# EAGLE design pneumatic_horse (EAGLE 9.6.2)
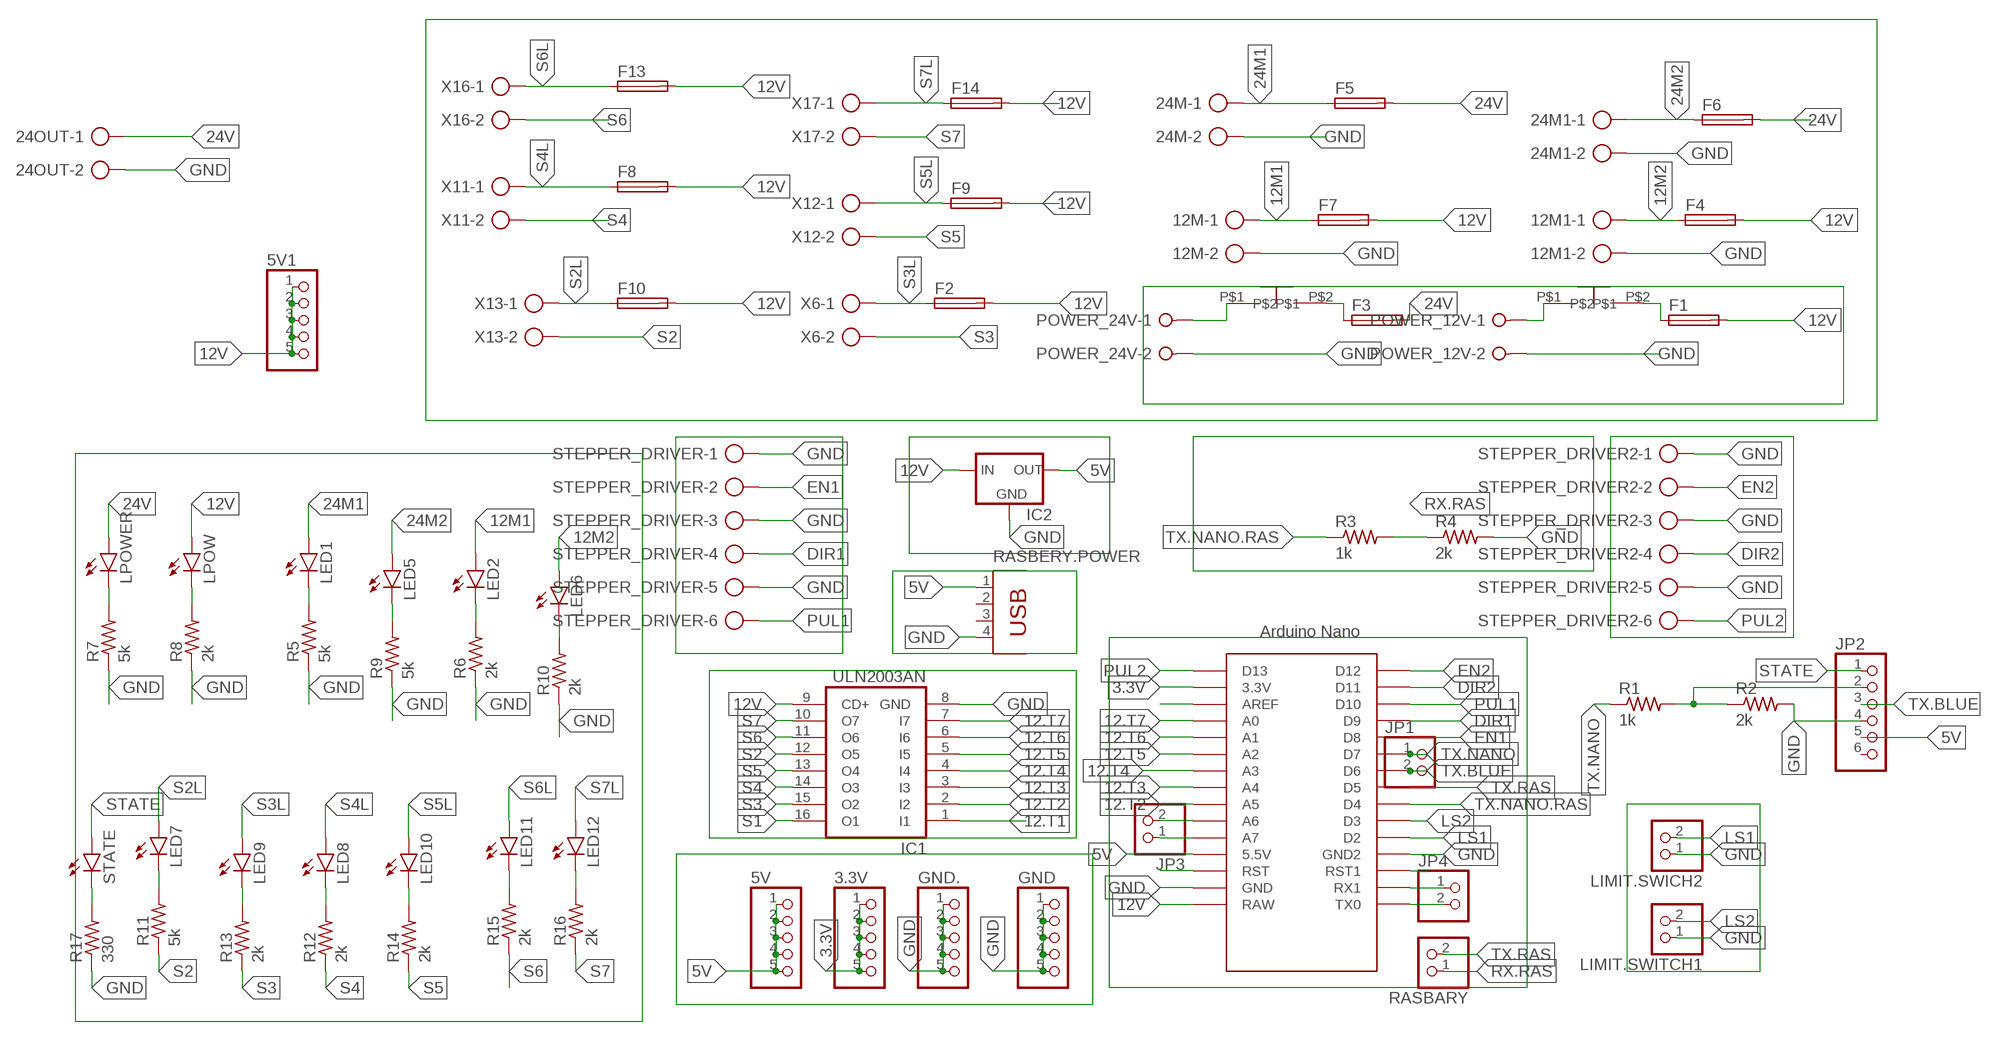
[diagram p0: schematic, sheet 1]

## Parts
3.3V  PINHD-1X5  [1X05]
5V  PINHD-1X5  [1X05]
5V1  PINHD-1X5  [1X05]
12M  AK300/2  [AK300/2]
12M1  AK300/2  [AK300/2]
24M  AK300/2  [AK300/2]
24M1  AK300/2  [AK300/2]
24OUT  AK300/2  [AK300/2]
F1  SH22,5A  [SH22,5A]
F2  SH22,5A  [SH22,5A]
F3  SH22,5A  [SH22,5A]
F4  SH22,5A  [SH22,5A]
F5  SH22,5A  [SH22,5A]
F6  SH22,5A  [SH22,5A]
F7  SH22,5A  [SH22,5A]
F8  SH22,5A  [SH22,5A]
F9  SH22,5A  [SH22,5A]
F10  SH22,5A  [SH22,5A]
F13  SH22,5A  [SH22,5A]
F14  SH22,5A  [SH22,5A]
GND  PINHD-1X5  [1X05]
GND.  PINHD-1X5  [1X05]
IC1  ULN2003AN  [DIL16]
IC2  78XXS  [78XXS]
JP1  PINHD-1X2  [1X02]
JP2  PINHD-1X6  [1X06]
JP3  PINHD-1X2  [1X02]
JP4  PINHD-1X2  [1X02]
LED1  LED3MM  [LED3MM]
LED2  LED3MM  [LED3MM]
LED5  LED3MM  [LED3MM]
LED6  LED3MM  [LED3MM]
LED7  LED3MM  [LED3MM]
LED8  LED3MM  [LED3MM]
LED9  LED3MM  [LED3MM]
LED10  LED3MM  [LED3MM]
LED11  LED3MM  [LED3MM]
LED12  LED3MM  [LED3MM]
LIMIT.SWICH2  PINHD-1X2  [1X02]
LIMIT.SWITCH1  PINHD-1X2  [1X02]
LPOW  LED5MM  [LED5MM]
LPOWER  LED3MM  [LED3MM]
POWER_12V  W237-2N  [W237-2N]
POWER_24V  W237-2N  [W237-2N]
R1  1k  R-US_0204/7  [0204/7]
R2  2k  R-US_0204/7  [0204/7]
R3  1k  R-US_0204/7  [0204/7]
R4  2k  R-US_0204/7  [0204/7]
R5  5k  R-US_0204/7  [0204/7]
R6  2k  R-US_0204/7  [0204/7]
R7  5k  R-US_0204/7  [0204/7]
R8  2k  R-US_0204/7  [0204/7]
R9  5k  R-US_0204/7  [0204/7]
R10  2k  R-US_0204/7  [0204/7]
R11  5k  R-US_0204/5  [0204/5]
R12  2k  R-US_0204/5  [0204/5]
R13  2k  R-US_0204/5  [0204/5]
R14  2k  R-US_0204/5  [0204/5]
R15  2k  R-US_0204/5  [0204/5]
R16  2k  R-US_0204/5  [0204/5]
R17  330  R-US_0204/5  [0204/5]
RASBARY  PINHD-1X2  [1X02]
RASBERY.POWER  PN87520  [PN87520]
STATE  LED3MM  [LED3MM]
STEPPER_DRIVER  AK300/6  [AK300/6]
STEPPER_DRIVER2  AK300/6  [AK300/6]
U$1  NANO  [NANO]
U$2  ON_OFF  [ON_OFF]
U$3  ON_OFF  [ON_OFF]
X6  AK300/2  [AK300/2]
X11  AK300/2  [AK300/2]
X12  AK300/2  [AK300/2]
X13  AK300/2  [AK300/2]
X16  AK300/2  [AK300/2]
X17  AK300/2  [AK300/2]

## Nets
3.3V: 3.3V.1 3.3V.2 3.3V.3 3.3V.4 3.3V.5 U$1.3.3V
5V: 5V.1 5V.2 5V.3 5V.4 5V.5 IC2.OUT JP2.5 RASBERY.POWER.1 U$1.5V(5.5V)
12.T1: IC1.1(I1)
12.T2: IC1.2(I2) U$1.A5
12.T3: IC1.3(I3) U$1.A4
12.T4: IC1.4(I4) U$1.A3
12.T5: IC1.5(I5) U$1.A2
12.T6: IC1.6(I6) U$1.A1
12.T7: IC1.7(I7) U$1.A0
12M1: 12M.1 F7.1 LED2.A
12M2: 12M1.1 F4.1 LED6.A
12V: 5V1.1 5V1.2 5V1.3 5V1.4 5V1.5 F1.2 F2.2 F4.2 F7.2 F8.2 F9.2 F10.2 F13.2 F14.2 IC1.9(CD+) IC2.IN LPOW.A U$1.RAW
24M1: 24M.1 F5.1 LED1.A
24M2: 24M1.1 F6.1 LED5.A
24V: 24OUT.1 F3.2 F5.2 F6.2 LPOWER.A
DIR1: STEPPER_DRIVER.4 U$1.D9
DIR2: STEPPER_DRIVER2.4 U$1.D11
EN1: STEPPER_DRIVER.2 U$1.D8
EN2: STEPPER_DRIVER2.2 U$1.D12
GND: 12M1.2 12M.2 24M1.2 24M.2 24OUT.2 GND.1 GND.2 GND.3 GND.4 GND.5 GND..1 GND..2 GND..3 GND..4 GND..5 IC1.8(GND) IC2.GND JP2.4 LIMIT.SWICH2.1 LIMIT.SWITCH1.1 POWER_12V.2 POWER_24V.2 R2.2 R4.2 R5.1 R6.1 R7.1 R8.1 R9.1 R10.1 R17.1 RASBERY.POWER.4 STEPPER_DRIVER2.1 STEPPER_DRIVER2.3 STEPPER_DRIVER2.5 STEPPER_DRIVER.1 STEPPER_DRIVER.3 STEPPER_DRIVER.5 U$1.GND U$1.GND1(GND2)
LS1: LIMIT.SWICH2.2 U$1.D2
LS2: LIMIT.SWITCH1.2 U$1.D3
N$1: POWER_24V.1 U$2.P$1
N$2: LED1.K(C) R5.2
N$4: F3.1 U$2.P$2
N$5: LED2.K(C) R6.2
N$7: LED5.K(C) R9.2
N$8: LED6.K(C) R10.2
N$9: LED7.K(C) R11.2
N$10: LPOWER.K(C) R7.2
N$11: LPOW.K(C) R8.2
N$12: LED8.K(C) R12.2
N$13: U$1.RST1
N$14: JP4.1 U$1.RX1
N$15: JP4.2 U$1.TX0
N$16: LED9.K(C) R13.2
N$18: U$1.AREF
N$19: LED10.K(C) R14.2
N$20: LED11.K(C) R15.2
N$21: LED12.K(C) R16.2
N$23: JP3.1 U$1.A7
N$25: JP3.2 U$1.A6
N$28: U$1.RST
N$34: JP2.2 R1.2 R2.1
N$35: R17.2 STATE.K(C)
N$36: POWER_12V.1 U$3.P$1
N$37: F1.1 U$3.P$2
PUL1: STEPPER_DRIVER.6 U$1.D10
PUL2: STEPPER_DRIVER2.6 U$1.D13
RX.RAS: R3.2 R4.1 RASBARY.1
S1: IC1.16(O1)
S2: IC1.12(O5) R11.1 X13.2
S2L: F10.1 LED7.A X13.1
S3: IC1.15(O2) R13.1 X6.2
S3L: F2.1 LED9.A X6.1
S4: IC1.14(O3) R12.1 X11.2
S4L: F8.1 LED8.A X11.1
S5: IC1.13(O4) R14.1 X12.2
S5L: F9.1 LED10.A X12.1
S6: IC1.11(O6) R15.1 X16.2
S6L: F13.1 LED11.A X16.1
S7: IC1.10(O7) R16.1 X17.2
S7L: F14.1 LED12.A X17.1
STATE: JP2.1 STATE.A
TX.BLUE: JP1.2 JP2.3 U$1.D6
TX.NANO: JP1.1 R1.1 U$1.D7
TX.NANO.RAS: R3.1 U$1.D4
TX.RAS: RASBARY.2 U$1.D5
Unconnected: JP2.6 RASBERY.POWER.2 RASBERY.POWER.3

## Library data of the parts
3.3V 5V 5V1 GND GND. = pinhead:PINHD-1X5: PIN HEADER
12M 12M1 24M 24M1 24OUT X6 X11-X13 X16 X17 = con-ptr500:AK300/2: CONNECTOR; OC_FARNELL: unknown; OC_NEWARK: unknown
F1-F10 F13 F14 = fuse:SH22,5A: FUSE HOLDER grid 22,5mm, isolated cap OGN0031 8201, Schurter (Buerklin); MPN: 0031.7701.11; OC_FARNELL: unknown; OC_NEWARK: 04F1224
IC1 = uln-udn:ULN2003A: DRIVER ARRAY
IC2 = v-reg:78XXS: VOLTAGE REGULATOR
JP1 JP3 JP4 LIMIT.SWICH2 LIMIT.SWITCH1 RASBARY = pinhead:PINHD-1X2: PIN HEADER
JP2 = pinhead:PINHD-1X6: PIN HEADER
LED1 LED2 LED5-LED12 LPOW LPOWER STATE = led:LED: LED OSRAM: - CHIPLED LG R971, LG N971, LY N971, LG Q971, LY Q971, LO R971, LY R971 LH N974, LH R974 LS Q976, LO Q976, LY Q976 LO Q996 - Hyper CHIPLED LW Q18S LB Q993, LB Q99A, LB R99A - SideLED LS A670, LO A670, LY A670, LG A670, LP A670 LB A673, LV A673, LT A673, LW A673 LH A674 LY A675 LS A676, LA A676, LO A676, LY A676, LW A676 LS A679, LY A679, LG A679 - Hyper Micro SIDELED® LS Y876, LA Y876, LO Y876, LY Y876 LT Y87S - SmartLED LW L88C, LW L88S LB L89C, LB L89S, LG L890 LS L89K, LO L89K, LY L89K LS L896, LA L896, LO L896, LY L896 - TOPLED LS T670, LO T670, LY T670, LG T670, LP T670 LSG T670, LSP T670, LSY T670, LOP T670, LYG T670 LG T671, LOG T671, LSG T671 LB T673, LV T673, LT T673, LW T673 LH T674 LS T676, LA T676, LO T676, LY T676, LB T676, LH T676, LSB T676, LW T676 LB T67C, LV T67C, LT T67C, LS T67K, LO T67K, LY T67K, LW E67C LS E67B, LA E67B, LO E67B, LY E67B, LB E67C, LV E67C, LT E67C LW T67C LS T679, LY T679, LG T679 LS T770, LO T770, LY T770, LG T770, LP T770 LB T773, LV T773, LT T773, LW T773 LH T774 LS E675, LA E675, LY E675, LS T675 LS T776, LA T776, LO T776, LY T776, LB T776 LHGB T686 LT T68C, LB T68C - Hyper Mini TOPLED® LB M676 - Mini TOPLED Santana® LG M470 LS M47K, LO M47K, LY M47K Source: http://www.osram.convergy.de LUXEON: - LUMILED® LXK2-PW12-R00, LXK2-PW12-S00, LXK2-PW14-U00, LXK2-PW14-V00 LXK2-PM12-R00, LXK2-PM12-S00, LXK2-PM14-U00 LXK2-PE12-Q00, LXK2-PE12-R00, LXK2-PE12-S00, LXK2-PE14-T00, LXK2-PE14-U00 LXK2-PB12-K00, LXK2-PB12-L00, LXK2-PB12-M00, LXK2-PB14-N00, LXK2-PB14-P00, LXK2-PB14-Q00 LXK2-PR12-L00, LXK2-PR12-M00, LXK2-PR14-Q00, LXK2-PR14-R00 LXK2-PD12-Q00, LXK2-PD12-R00, LXK2-PD12-S00 LXK2-PH12-R00, LXK2-PH12-S00 LXK2-PL12-P00, LXK2-PL12-Q00, LXK2-PL12-R00 Source: www.luxeon.com KINGBRIGHT: KA-3528ASYC Source: www.kingbright.com
POWER_12V POWER_24V = con-wago-508:W237-2N: WAGO SREW CLAMP; OC_FARNELL: unknown; OC_NEWARK: unknown
R1-R17 = rcl:R-US_: RESISTOR, American symbol; SPICEPREFIX: R
RASBERY.POWER = con-berg:PN87520: BERG USB connector; OC_FARNELL: unknown; OC_NEWARK: unknown
STEPPER_DRIVER STEPPER_DRIVER2 = con-ptr500:AK300/6: CONNECTOR; OC_FARNELL: unknown; OC_NEWARK: unknown
U$1 = Arduino-clone:NANO: Arduino Nano
U$2 U$3 = ON_OFF:ON_OFF

## Board
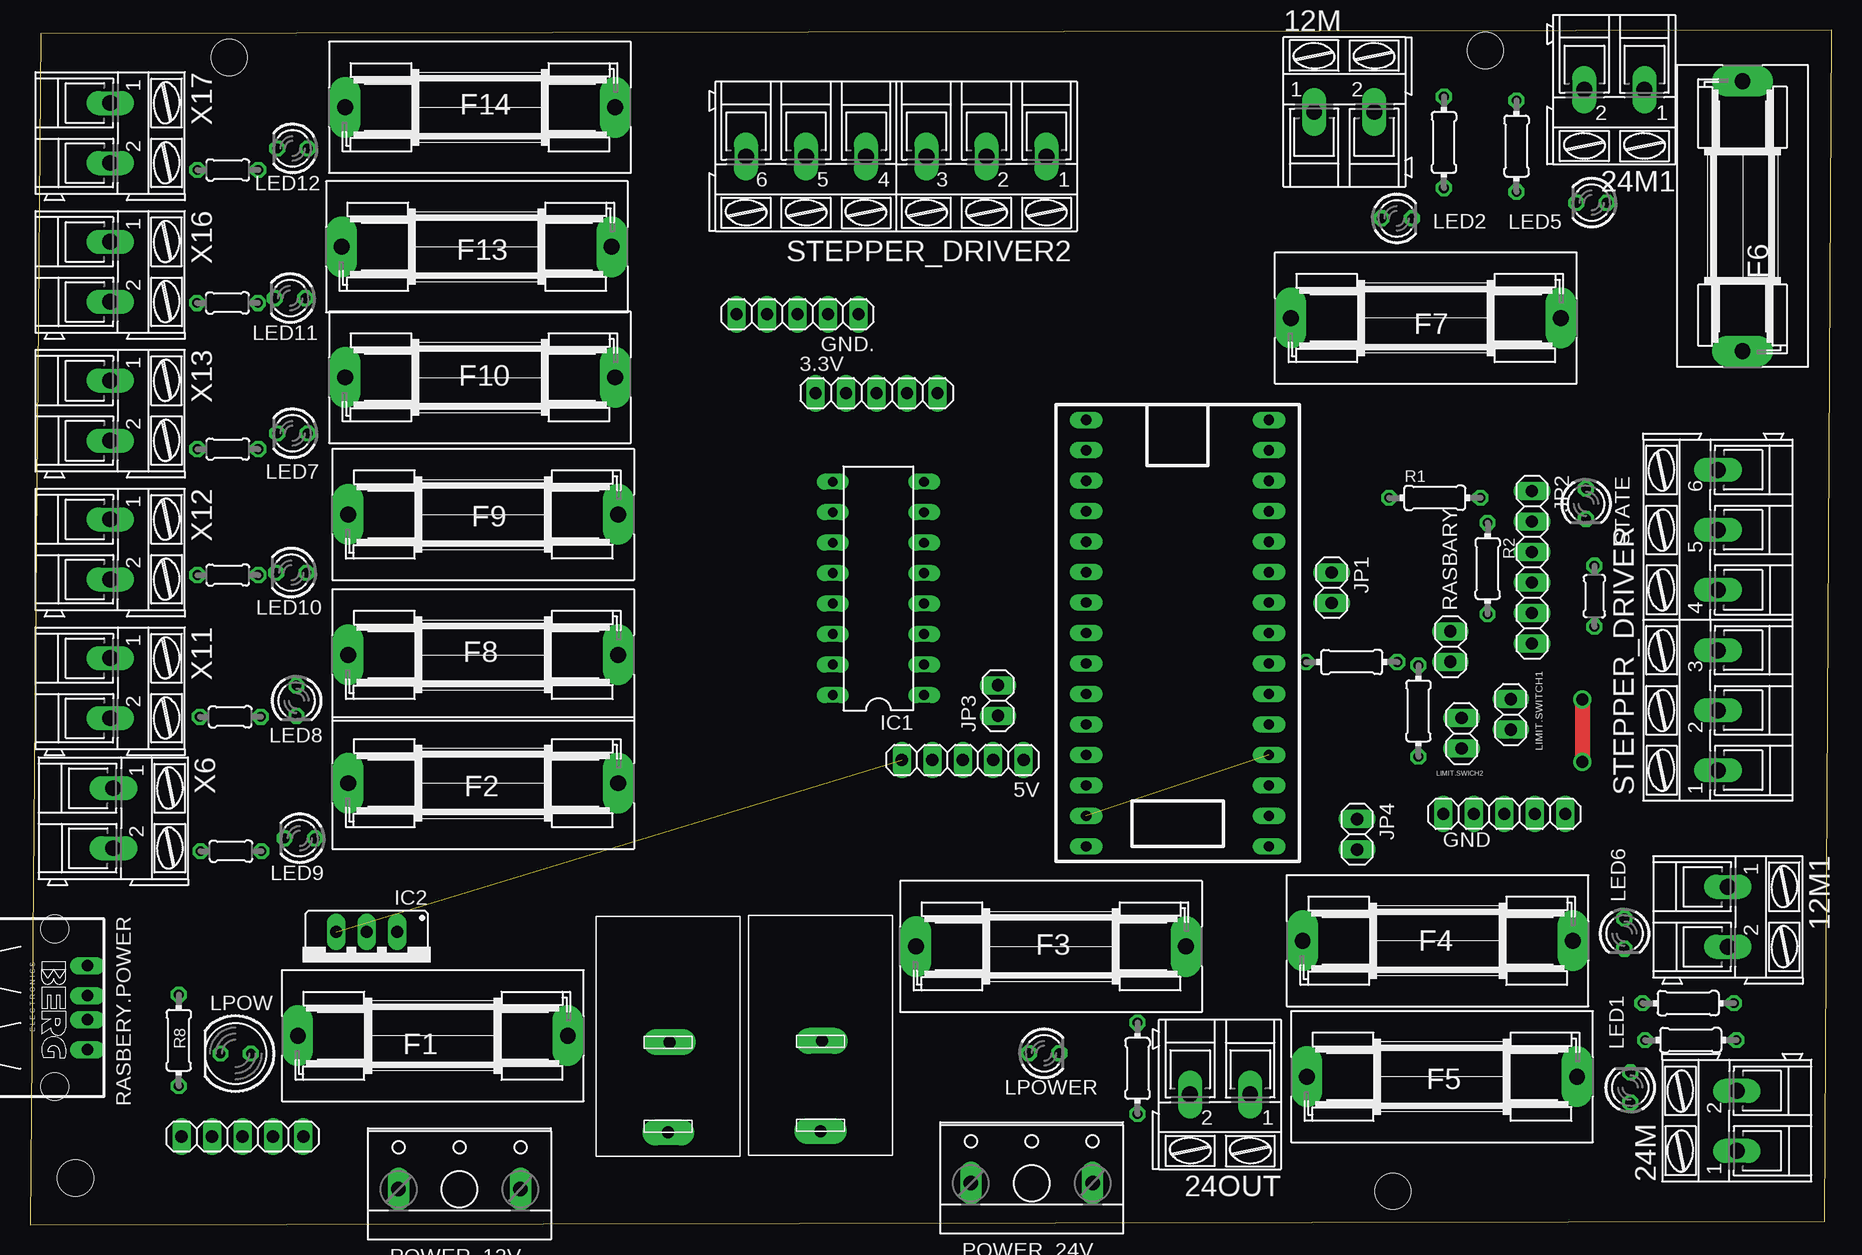
[diagram p1: board, top side]
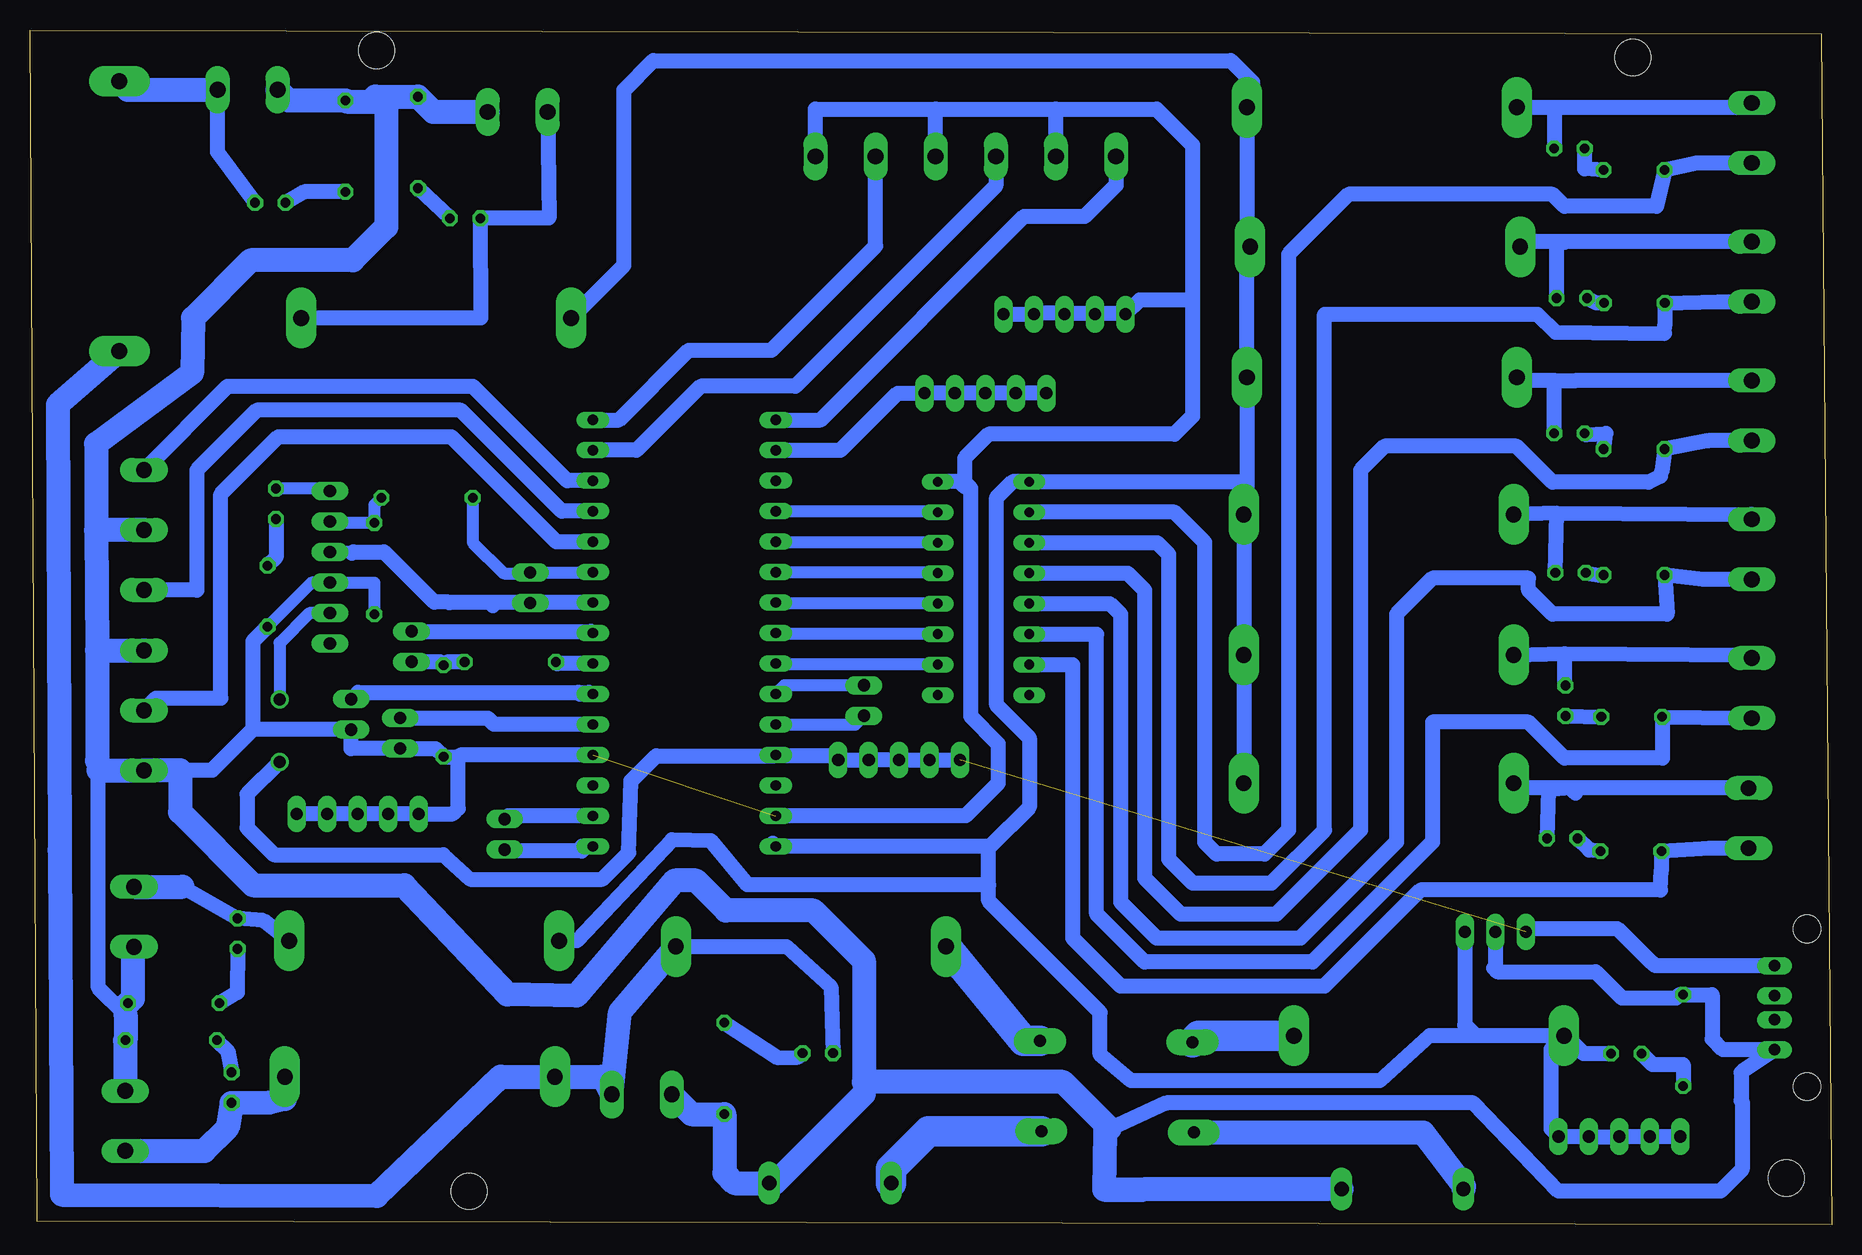
[diagram p2: board, bottom side, seen from below]

Size 150.2 x 99.6 mm. Coordinates in mm from the lower left corner, seen from the top.
Outline: 0,0 149.6,0.3 150.2,99.6 0.9,99.3 0,0
Copper layers (1*16): Top 0.035mm / dielectric 1.5mm / Bottom 0.035mm
Design rules "default": minimum track width 6mil, minimum drill 0.35mm, track to track 6mil, track to pad 6mil, pad to pad 6mil, via to via 6mil, smd to smd 6mil, copper to edge 40mil, drill to drill 6mil, minimum pad ring 10mil, minimum via ring 8mil, stop-mask expansion 4mil, vias tented up to drill 0mil, thermal gap 10mil
Holes 3 mm at 16.6,97.3 3.8,3.9 121.3,97.9 113.6,2.8

### Footprints (pad centres in the part's own frame; a part is rotated, then mirrored left to right if it is on the bottom)
1X05 = drill 1.016 long: 1 -5.08,0; 2 -2.54,0; 3 0,0; 4 2.54,0; 5 5.08,0
AK300/2 = drill 1.321 long: 1 -2.515,0; 2 2.489,0
SH22,5A = drill 1.321 pad 2.54 long: 1 -11.252,0; 2 11.252,0
DIL16 = drill 0.813 long: 1 -8.89,-3.81; 2 -6.35,-3.81; 3 -3.81,-3.81; 4 -1.27,-3.81; 5 1.27,-3.81; 6 3.81,-3.81; 7 6.35,-3.81; 8 8.89,-3.81; 9 8.89,3.81; 10 6.35,3.81; 11 3.81,3.81; 12 1.27,3.81; 13 -1.27,3.81; 14 -3.81,3.81; 15 -6.35,3.81; 16 -8.89,3.81
78XXS = drill 1.016 long: GND 0,-2.54; IN -2.54,-2.54; OUT 2.54,-2.54
1X02 = drill 1.016 long: 1 -1.27,0; 2 1.27,0
1X06 = drill 1.016 long: 1 -6.35,0; 2 -3.81,0; 3 -1.27,0; 4 1.27,0; 5 3.81,0; 6 6.35,0
LED3MM = drill 0.813 octagon: A -1.27,0; K 1.27,0
LED5MM = drill 0.813 octagon: A -1.27,0; K 1.27,0
W237-2N = drill 1.194 long: 1 -5.08,-0.635; 2 5.08,-0.635
0204/7 = drill 0.813 octagon: 1 -3.81,0; 2 3.81,0
0204/5 = drill 0.813 octagon: 1 -2.54,0; 2 2.54,0
PN87520 = drill 0.95 long: 1 -3.5,2.71; 2 -1,2.71; 3 1,2.71; 4 3.5,2.71 | hole 2.3: -6.57,0; 6.57,0
AK300/6 = drill 1.321 long: 1 -12.522,0; 2 -7.518,0; 3 -2.515,0; 4 2.515,0; 5 7.518,0; 6 12.522,0
NANO = drill 0.85 long: 3.3V -10.16,24.13; 5V -10.16,-1.27; A0 -10.16,19.05; A1 -10.16,16.51; A2 -10.16,13.97; A3 -10.16,11.43; A4 -10.16,8.89; A5 -10.16,6.35; A6 -10.16,3.81; A7 -10.16,1.27; AREF -10.16,21.59; D2 5.08,1.27; D3 5.08,3.81; D4 5.08,6.35; D5 5.08,8.89; D6 5.08,11.43; D7 5.08,13.97; D8 5.08,16.51; D9 5.08,19.05; D10 5.08,21.59; D11 5.08,24.13; D12 5.08,26.67; D13 -10.16,26.67; GND -10.16,-6.35; GND1 5.08,-1.27; RAW -10.16,-8.89; RST -10.16,-3.81; RST1 5.08,-3.81; RX1 5.08,-6.35; TX0 5.08,-8.89
ON_OFF = drill 1 pad 2.184 long: P$1 2,9; P$2 9.525,8.89

### Placement (x,y rotation side)
3.3V  70.57,69.32 0 top
5V  77.75,38.74 180 top
5V1  17.71,7.35 0 top
12M  109.56,92.77 0 top
12M1  141.53,25.66 270 top
24M  142.27,8.67 90 top
24M1  132.05,94.62 180 top
24OUT  99.19,10.86 180 top
F1  33.58,15.75 180 top
F2  37.78,36.81 0 top
F3  85.11,23.2 0 top
F4  117.34,23.67 180 top
F5  117.7,12.34 180 top
F6  142.75,84.07 270 top
F7  116.35,75.59 180 top
F8  37.78,47.51 0 top
F9  37.78,59.21 0 top
F10  37.51,70.64 0 top
F13  37.24,81.53 0 top
F14  37.51,93.15 0 top
GND  122.89,34.25 0 top
GND.  63.98,75.9 180 top
IC1  70.72,53.05 90 top
IC2  28.06,21.88 180 top
JP1  108.5,53.1 270 top
JP2  125.2,54.8 270 top
JP3  80.69,43.7 90 top
JP4  110.63,32.54 270 top
LED1  133.4,11.43 90 top
LED2  113.93,83.9 0 top
LED5  130.17,85.2 180 top
LED6  132.9,24.27 270 top
LED7  21.88,65.97 180 top
LED8  22.21,43.68 270 top
LED9  22.48,32.21 180 top
LED10  21.78,54.35 180 top
LED11  21.68,77.24 180 top
LED12  21.88,89.72 180 top
LIMIT.SWICH2  119.34,40.97 90 top
LIMIT.SWITCH1  123.43,42.54 90 top
LPOW  17.14,14.27 180 top
LPOWER  84.53,14.3 0 top
POWER_12V  35.8,3.6 0 top
POWER_24V  83.5,4.1 0 top
R1  117.1,60.6 0 top
R2  121.5,54.7 270 top
R3  110.17,46.91 0 top
R4  115.73,42.83 270 top
R5  138.43,15.39 180 top
R6  117.86,90.23 270 top
R7  92.32,13.03 90 top
R8  12.4,15.37 270 top
R9  123.91,89.92 270 top
R10  138.22,18.47 180 top
R11  16.49,64.66 0 top
R12  16.69,42.34 0 top
R13  16.75,31.14 0 top
R14  16.49,54.16 0 top
R15  16.46,76.84 0 top
R16  16.49,87.93 0 top
R17  130.4,52.4 90 top
RASBARY  118.4,48.2 90 top
RASBERY.POWER  2.07,18.09 270 top
STATE  129.7,60.1 270 top
STEPPER_DRIVER  140.7,50.4 90 top
STEPPER_DRIVER2  72.2,89.06 180 top
U$1  98.2,40.43 0 top
U$2  74.9,5.8 90 top
U$3  62.2,5.7 90 top
X6  6.95,33.88 270 top
X11  6.68,44.72 270 top
X12  6.68,56.29 270 top
X13  6.68,67.86 270 top
X16  6.68,79.43 270 top
X17  6.68,91 270 top

### Tracks (layer width: path | path; a pad name or v marks a point on that pad's centre or on a via)
3.3V
  Bottom 1.27: U$1.3.3V 82.64,64.56 77.88,69.32 3.3V.5 3.3V.4 3.3V.3 3.3V.2 3.3V.1
5V  (via drill 1)  (1 unrouted)
  Top 1.27: v129.4,43.8 v129.4,38.6
  Bottom 1: JP2.5 126.91,50.99 129.4,48.5 v129.4,43.8
  Bottom 1.27: 5V.5 5V.4 5V.3 5V.2 5V.1 83.23,39.14 88.02,39.14 U$1.5V 88.1,39.1 98,39.1 100.1,37 100.3,31 102.5,28.8 113.5,28.8 115.75,30.85 129.85,30.85 132.1,33.1 132.1,35.9 v129.4,38.6 | v129.4,43.8 129.4,43.7 | IC2.OUT 25.24,24.7 17.9,24.7 15.2,22 14.69,21.6 RASBERY.POWER.1
12.T2
  Bottom 1: IC1.2 88.1,46.7 88.18,46.78 | 88.3,46.9 88.18,46.78 | 88.18,46.78 U$1.A5
12.T3
  Bottom 1: IC1.3 87.96,49.24 U$1.A4
12.T4
  Bottom 1: IC1.4 87.96,51.78 U$1.A3
12.T5
  Bottom 1: U$1.A2 74.61,54.4 IC1.5
12.T6
  Bottom 1: IC1.6 87.96,56.86 U$1.A1
12.T7
  Bottom 1: U$1.A0 74.61,59.48 IC1.7
12M1
  Bottom 1.27: 12M.1 106.94,83.93 LED2.A 112.63,75.59 F7.1
12M2
  Bottom 1.27: 137.48,28.17 LED6.A 130.78,25.36 F4.1
  Bottom 2: 12M1.1 137.48,28.17
12V
  Bottom 1.27: F14.2 48.76,92.9 | 48.76,92.9 48.76,81.53 | 48.76,81.53 F13.2 | 48.76,81.53 F10.2 48.76,61.94 | 49.03,58.9 48.76,58.9 48.76,61.94 | 49.3,58.9 49.03,58.9 | 49.03,58.9 F9.2 F8.2 F2.2 49.03,35.9 49.3,35.9 | 48.76,61.94 IC1.9 68.3,61.95 69.62,60.63 69.62,43.32 66.9,40.6 66.9,34.8 70.16,31.54 | F7.2 100.7,79.99 100.7,94.6 98.25,97.05 50.1,97.05 48.3,95.25 48.3,93.36 48.76,92.9 | 70.16,31.54 70.3,31.4 70.3,28.3 | 70.16,31.54 U$1.RAW 88.3,31.8 | F1.2 29.7,15.75 | 29.7,15.75 33.55,15.75 37.7,12 58.4,12 61,14.2 61,17.7 70.3,27 70.3,28.3 | F1.2 22.19,15.75 20.71,14.27 LPOW.A | IC2.IN 30.6,16.65 29.7,15.75 | F1.2 23.43,14.65 23.43,7.99 5V1.5 5V1.4 5V1.3 5V1.2 5V1.1 | 70.3,28.3 70.35,28.35 90.4,28.35 93.45,32 96.7,32.1 104.63,23.67 F4.2
24M1
  Bottom 2: F5.1 128.95,10.48 130.24,10.19 LED1.A 133.74,8.09 135.68,6.16 24M.1
24M2
  Bottom 1.27: LED5.A 134.56,89.43 24M1.1 134.59,94.6
  Bottom 2: F6.1 142.05,94.62 24M1.1
24V
  Bottom 1.27: F3.2 87.14,23.2 83.45,19.81 LPOWER.A
  Bottom 2: F3.2 101,17.76 24OUT.1 102.48,12.34 F5.2 110.96,12.34 121.3,2.4 147.55,2.5 147.73,31.21 147.87,68.37 F6.2
DIR1
  Bottom 1.27: U$1.D9 105.88,59.48 114.3,67.9 131.3,67.9 136.3,62.9 136.3,52.9 141.3,52.9 141.29,52.91 STEPPER_DRIVER.4
DIR2
  Bottom 1.27: STEPPER_DRIVER2.4 69.69,86.62 86.4,69.9 94.3,69.9 99.64,64.56 U$1.D11
EN1
  Bottom 1.27: U$1.D8 106.34,56.94 115.09,65.69 129.51,65.69 134.3,60.9 134.3,43.9 139.68,43.9 STEPPER_DRIVER.2
EN2
  Bottom 1.27: U$1.D12 101.1,67.1 95.3,72.9 88.4,72.9 79.72,81.58 STEPPER_DRIVER2.2
GND  (1 unrouted)
  Bottom 1: R17.1 126.73,53.53 JP2.4 121.53,53.53 121.5,53.5 R2.2
  Bottom 1.27: 114.5,39 115.71,39 R4.2 116.41,39.7 LIMIT.SWICH2.1 123.43,39.7 LIMIT.SWITCH1.1 131.63,41.27 | STEPPER_DRIVER2.5 64.68,93 | 74.72,93 84.72,93 STEPPER_DRIVER2.1 | 74.72,93 64.68,93 | R9.1 123.82,93.64 | 120.5,93.64 121.4,93.64 121.4,94.04 | 64.68,93 56.3,93 53.3,90 53.3,77.1 | 53.3,77.1 53.3,67.4 54.8,65.9 70.3,65.9 72.3,63.9 72.3,61.9 | IC1.8 72.74,61.94 72.3,61.5 72.3,61.9 | 144.5,37.88 144.6,38.7 144.5,38.7 144.5,37.88 | 72.3,61.9 71.8,61.4 71.8,42.4 69.5,40.1 69.5,36.8 72.22,34.08 U$1.GND | 131.63,41.27 135,37.9 137.7,37.9 | STEPPER_DRIVER.1 140.68,37.9 | R17.1 131.63,48.63 131.63,41.27 | R10.1 142.24,18.26 142.24,17.5 144.5,19.76 144.5,37.88 | R5.1 142.27,15.36 | 61.54,76 63.88,76 GND..3 64.08,76 66.42,76 GND..2 GND..1 | 61.54,76 59,76 GND..5 57.7,77.1 53.3,77.1 | 114.5,39 114.5,34.7 114.95,34.25 GND.1 GND.2 GND.3 GND.4 GND.5 | IC2.GND 28.06,21.54 28.2,21.4 27.9,21.1 19.7,21.1 17.5,18.9 13,18.9 12.72,19.18 R8.1 9.98,19.18 9.98,15.49 9.08,14.59 RASBERY.POWER.4 7.48,12.77 7.57,12.68 7.57,10.36 7.48,10.27 7.48,4.62 9.3,2.8 22.8,2.8 29.9,10.15 55.45,10.15 60.58,7.77 60.5,8 60.2,8 | 80.7,11.9 80.7,10.9 | U$1.GND1 114.34,39.16 114.5,39 | 141.63,23.17 | STEPPER_DRIVER2.3 74.72,93 | GND..4 61.54,76
  Bottom 2: 24M1.2 128.67,93.73 R9.1 | 123.82,93.64 121.4,93.64 | 121.4,94.04 R6.1 116.59,92.77 12M.2 | STEPPER_DRIVER.5 140.72,57.9 144.7,57.9 | 144.6,47.88 STEPPER_DRIVER.3 | 144.7,57.9 144.6,47.88 | 144.6,47.88 144.6,38.7 | 144.5,37.88 STEPPER_DRIVER.1 | 140.68,37.9 137.7,37.9 137.7,34.4 131.6,28.3 119,28.3 110.4,19.2 104.64,19.1 96.44,28.7 94.7,28.7 92.2,26.2 84.9,26.2 80.7,22 80.7,11.9 64.1,11.9 60.2,8 | 141.63,23.17 141.63,18.87 R10.1 | 142.24,17.5 R5.1 | 142.27,15.36 24M.2 | 120.5,93.64 120.5,83.2 123.3,80.4 131.8,80.4 136.6,75.6 136.7,71 144.7,65.1 144.7,57.9 | 12M1.2 141.63,23.17 | 60.58,7.77 60.68,2.93 | 60.68,2.93 57.55,2.9 | POWER_12V.2 57.21,2.96 60.68,2.93 | 80.7,10.9 88.13,3.46 POWER_24V.2 91.47,3.46 92.32,4.32 R7.1 95.06,9.22 24OUT.2
LS1
  Bottom 1.27: LIMIT.SWICH2.2 112.04,42.24 111.54,41.74 103.32,41.74 U$1.D2
LS2
  Bottom 1.27: LIMIT.SWITCH1.2 122.85,44.39 104.5,44.39 | 104.5,44.39 103.6,44.39 | U$1.D3 104.35,44.24 104.5,44.39
N$1
  Bottom 2.54: U$2.P$1 75.3,7.8 78.42,4.68 POWER_24V.1
N$2
  Bottom 1.27: R5.2 133.74,14.51 LED1.K
N$4
  Bottom 2.54: U$2.P$2 67.38,15.33 F3.1
N$5
  Bottom 1.27: LED2.K 117.81,86.37 R6.2
N$7
  Bottom 1.27: R9.2 127.33,86.11 LED5.K
N$8
  Bottom 1.27: LED6.K 132.91,19.37 R10.2
N$9
  Bottom 1.27: R11.2 18.83,65.96 20.5,65.86 LED7.K
N$10
  Bottom 1.27: R7.2 87.86,13.92 86.21,13.97 LPOWER.K
N$11
  Bottom 1.27: LPOW.K 14.97,13.37 12.4,13.37 R8.2
N$12
  Bottom 1.27: R12.2 19.23,42.31 LED8.K
N$14
  Bottom 1.27: JP4.1 110.33,34.11 104.9,34.11 | 104.9,34.11 104.3,34.11 | U$1.RX1 104.87,34.08 104.9,34.11
N$15
  Bottom 1.27: U$1.TX0 104.21,31.54 104.21,31.16 110.63,31.16 JP4.2
N$16
  Bottom 1.27: R13.2 20.24,31.24 LED9.K
N$19
  Bottom 1.27: LED10.K 19.42,54.16 R14.2
N$20
  Bottom 1.27: R15.2 19.61,76.84 LED11.K
N$21
  Bottom 1.27: R16.2 20.61,88.03 LED12.K
N$23
  Bottom 1: U$1.A7 81.42,41.7 JP3.1
N$25
  Bottom 1: JP3.2 87.31,44.97 U$1.A6
N$34
  Bottom 1: R1.2 121.5,60.01 R2.1 125.1,58.51 JP2.2
N$35
  Bottom 1.27: STATE.K 129.7,55.64 R17.2
N$36
  Bottom 2: U$3.P$1 34.08,7.7 30.65,3.17 POWER_12V.1
N$37
  Bottom 2.54: F1.1 52.78,15.75 U$3.P$2
PUL1
  Bottom 1.27: U$1.D10 105.42,62.02 113.3,69.9 133.72,69.9 STEPPER_DRIVER.6
PUL2
  Bottom 1.27: STEPPER_DRIVER2.6 59.68,86.66 62.28,84.06 67.34,84.06 84.3,67.1 U$1.D13
RX.RAS
  Bottom 1.27: R3.2 115.46,46.91 R4.1 116.03,46.94 RASBARY.1
S2
  Bottom 1.27: X13.2 10.31,65.37 R11.1 14.17,62.84 14.3,62.4 15.3,61.9 23.3,61.9 26.3,64.9 37.3,64.9 39.3,62.9 39.3,32.9 46.3,25.9 54.3,25.9 57.3,28.9 57.3,52.9 58.72,54.32 IC1.12
S2L
  Bottom 1.27: X13.1 21.3,70.38 23.15,70.38 | 23.15,70.38 26.26,70.38 F10.1 | LED7.A 23.15,70.38
S3
  Bottom 1.27: X6.2 10.19,31.39 R13.1 14.21,29.59 14.3,27.9 34.3,27.9 42.3,19.9 59.3,19.9 63.3,23.9 63.3,46.7 IC1.15
S3L
  Bottom 1.27: X6.1 21.8,36.39 | 21.8,36.39 26.53,36.39 F2.1 | 21.38,35.98 21.8,36.39 | 21.8,36.39 23.65,36.24 LED9.A
S4
  Bottom 1.27: X11.2 7.01,41.9 7.3,41.9 7.64,42.24 R12.1 14.12,38.9 22.3,38.9 25.3,41.9 33.3,41.9 33.3,31.9 43.3,21.9 57.3,21.9 61.3,25.9 61.3,49.24 IC1.14
S4L
  Bottom 1.27: F8.1 22.3,47.61 | 22.3,47.61 6.68,47.51 X11.1 | 22.3,47.61 22.3,45.16 LED8.A
S5
  Bottom 1.27: X12.2 10.76,53.8 R14.1 13.74,50.9 23.3,50.9 25.3,52.9 25.3,53.9 33.3,53.9 36.3,50.9 36.3,31.9 44.3,23.9 56.3,23.9 59.3,26.9 59.3,50.9 60.18,51.78 IC1.13
S5L
  Bottom 1.27: 22.95,59.31 6.68,59.21 X12.1 | LED10.A 22.95,59.31 | 22.95,59.31 F9.1
S6
  Bottom 1.27: X16.2 9.45,76.94 R15.1 13.92,75.04 13.97,74.29 23.03,74.39 24.54,75.9 42.3,75.9 42.3,32.89 46.71,28.48 53.3,28.48 55.3,30.48 55.3,55.9 56.26,56.86 IC1.11
S6L
  Bottom 1.27: X16.1 22.3,81.95 | 22.3,81.95 25.99,81.95 F13.1 | LED11.A 22.95,81.8 22.3,81.9 22.3,81.95
S7
  Bottom 1.27: X17.2 11.27,88.51 R16.1 14.62,84.9 22.3,84.9 23.3,85.9 40.3,85.9 45.3,80.9 45.3,32.9 47.3,30.9 51.3,30.9 52.3,31.9 52.3,56.9 54.8,59.4 IC1.10
S7L
  Bottom 1.27: 23.3,93.15 F14.1 25.69,93.72 | 23.3,93.15 6.68,93.15 X17.1 | 23.3,93.15 23.15,93 LED12.A
STATE
  Bottom 1: JP2.1 125.42,61.37 STATE.A
  Bottom 1.27: STATE.A 129.63,61.3
TX.BLUE
  Bottom 1: JP1.2 108.47,51.86 U$1.D6 | 123.37,55.97 123.47,56.07 JP2.3
  Bottom 1.27: 111.63,51.86 111.63,51.59 | U$1.D6 111.63,51.86 | 111.63,51.86 115.26,51.86 115.3,51.9 116.5,51.9 120.7,56.1 123.24,56.1 123.37,55.97
TX.NANO
  Bottom 1: U$1.D7 103.31,54.37 JP1.1 108.57,54.3 110.7,54.3 113.29,56.89 R1.1
  Bottom 1.27: U$1.D7 103.31,54.43
TX.NANO.RAS
  Bottom 1.27: U$1.D4 106.23,46.78 R3.1
TX.RAS
  Bottom 1.27: RASBARY.2 103.43,49.47 U$1.D5